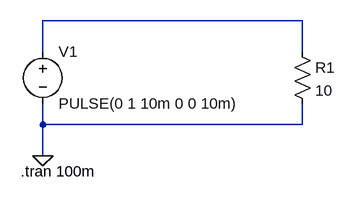
[diagram p0: schematic Yoneda-p48__Puls+R.asc]
Yoneda-p48__Puls+R.asc, the LTspice schematic file:
Version 4
SHEET 1 880 680
WIRE 816 -432 416 -432
WIRE 416 -384 416 -432
WIRE 816 -384 816 -432
WIRE 416 -272 416 -304
WIRE 816 -272 816 -304
WIRE 816 -272 416 -272
WIRE 416 -224 416 -272
FLAG 416 -224 0
SYMBOL voltage 416 -400 R0
WINDOW 123 0 0 Left 2
WINDOW 39 0 0 Left 2
SYMATTR InstName V1
SYMATTR Value PULSE(0 1 10m 0 0 10m)
SYMBOL res 800 -400 R0
SYMATTR InstName R1
SYMATTR Value 10
TEXT 382 -200 Left 2 !.tran 100m

The netlist it stands for:
* Yoneda-p48__Puls+R.asc
V1 N001 0 PULSE(0 1 10m 0 0 10m)
R1 N001 0 10
.tran 100m
.backanno
.end